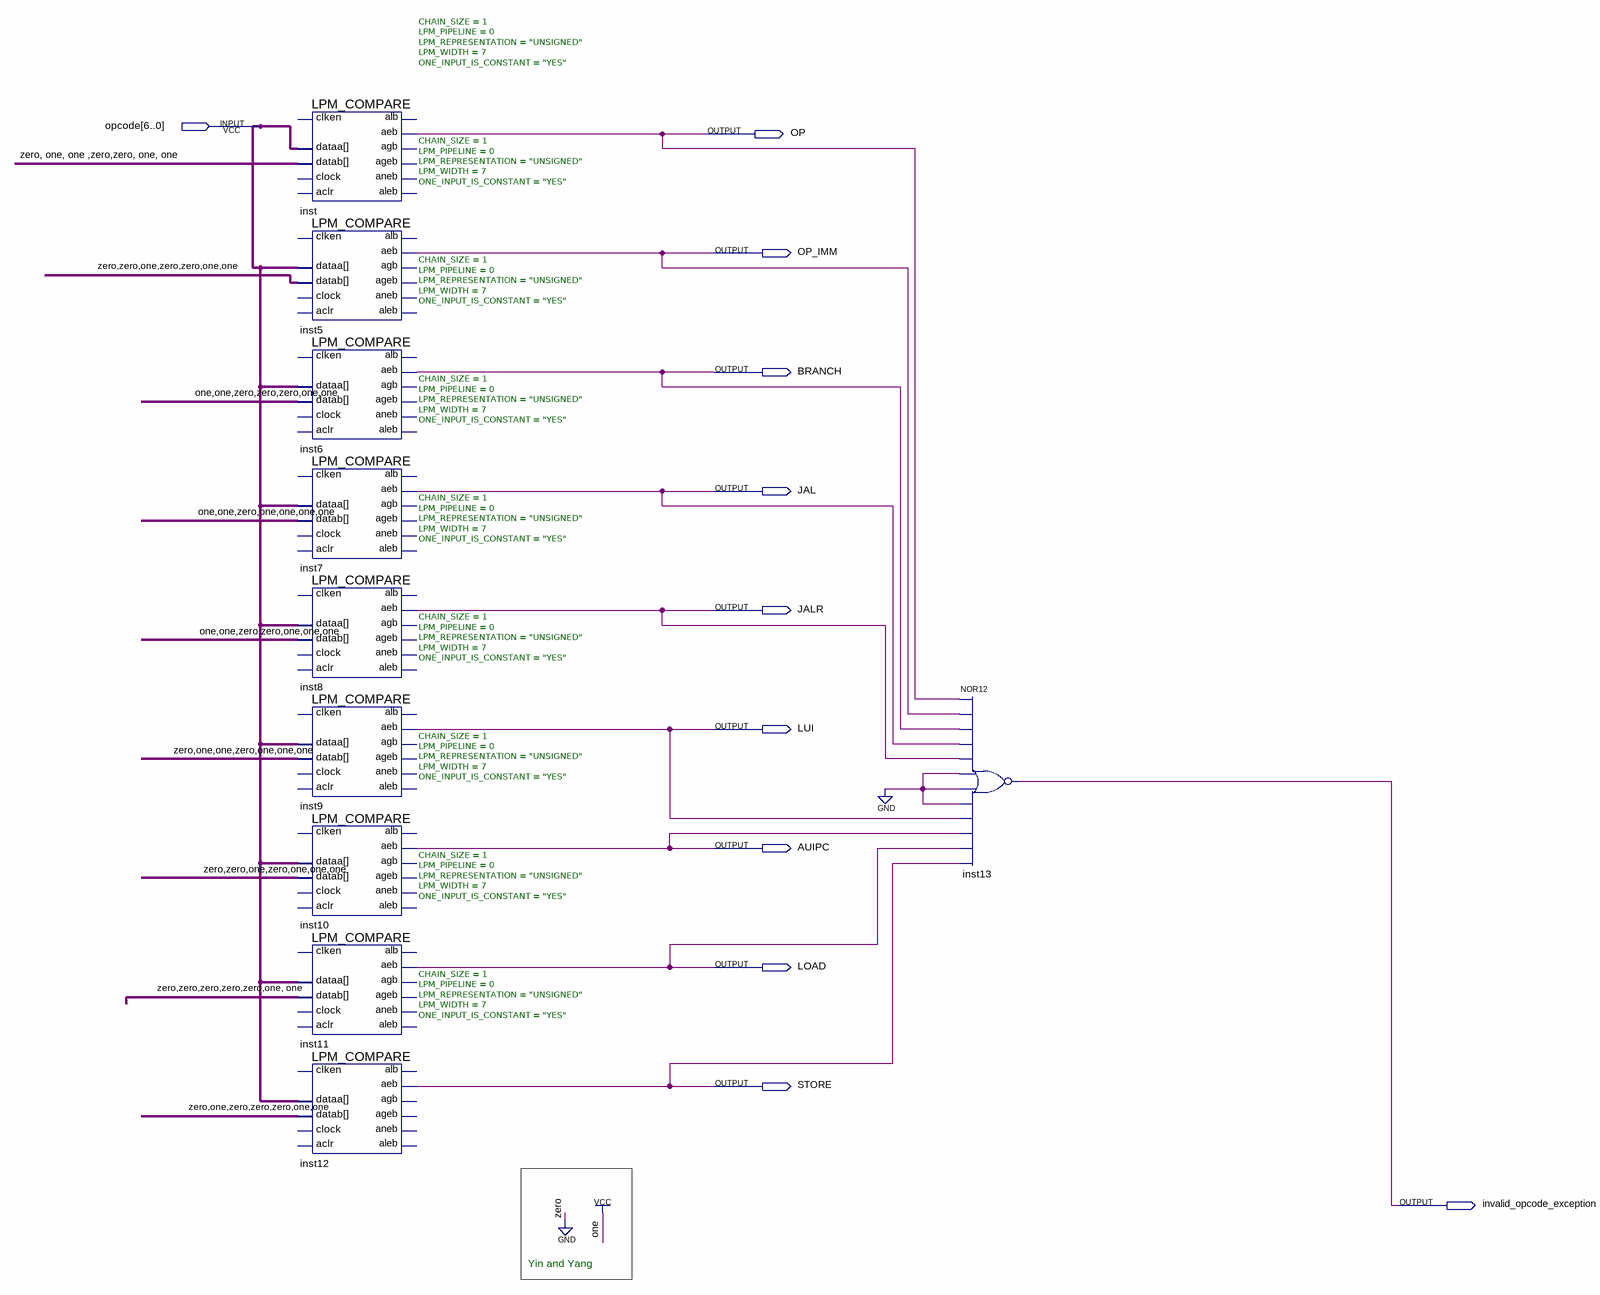
[diagram p0: schematic sheet]
// Quartus schematic OpcodeDecoder.bdf as structural Verilog: 10 symbols, 11 pins
module OpcodeDecoder (
  input  [6:0] opcode,
  output OP,
  output OP_IMM,
  output BRANCH,
  output JAL,
  output JALR,
  output LUI,
  output AUIPC,
  output LOAD,
  output STORE,
  output invalid_opcode_exception
);

  LPM_COMPARE #(.CHAIN_SIZE(1), .LPM_PIPELINE(0), .LPM_REPRESENTATION("UNSIGNED"), .LPM_WIDTH(7), .ONE_INPUT_IS_CONSTANT("YES")) inst (
    .dataa(opcode), .datab(7'b0110011), .aeb(OP));  // open: clock, aclr, clken, aleb, agb, aneb, ageb, alb
  LPM_COMPARE #(.CHAIN_SIZE(1), .LPM_PIPELINE(0), .LPM_REPRESENTATION("UNSIGNED"), .LPM_WIDTH(7), .ONE_INPUT_IS_CONSTANT("YES")) inst5 (
    .dataa(opcode), .datab(7'b0010011), .aeb(OP_IMM));  // open: clock, aclr, clken, aleb, agb, aneb, ageb, alb
  LPM_COMPARE #(.CHAIN_SIZE(1), .LPM_PIPELINE(0), .LPM_REPRESENTATION("UNSIGNED"), .LPM_WIDTH(7), .ONE_INPUT_IS_CONSTANT("YES")) inst6 (
    .dataa(opcode), .datab(7'b1100011), .aeb(BRANCH));  // open: clock, aclr, clken, aleb, agb, aneb, ageb, alb
  LPM_COMPARE #(.CHAIN_SIZE(1), .LPM_PIPELINE(0), .LPM_REPRESENTATION("UNSIGNED"), .LPM_WIDTH(7), .ONE_INPUT_IS_CONSTANT("YES")) inst7 (
    .dataa(opcode), .datab(7'b1101111), .aeb(JAL));  // open: clock, aclr, clken, aleb, agb, aneb, ageb, alb
  LPM_COMPARE #(.CHAIN_SIZE(1), .LPM_PIPELINE(0), .LPM_REPRESENTATION("UNSIGNED"), .LPM_WIDTH(7), .ONE_INPUT_IS_CONSTANT("YES")) inst8 (
    .dataa(opcode), .datab(7'b1100111), .aeb(JALR));  // open: clock, aclr, clken, aleb, agb, aneb, ageb, alb
  LPM_COMPARE #(.CHAIN_SIZE(1), .LPM_PIPELINE(0), .LPM_REPRESENTATION("UNSIGNED"), .LPM_WIDTH(7), .ONE_INPUT_IS_CONSTANT("YES")) inst9 (
    .dataa(opcode), .datab(7'b0110111), .aeb(LUI));  // open: clock, aclr, clken, aleb, agb, aneb, ageb, alb
  LPM_COMPARE #(.CHAIN_SIZE(1), .LPM_PIPELINE(0), .LPM_REPRESENTATION("UNSIGNED"), .LPM_WIDTH(7), .ONE_INPUT_IS_CONSTANT("YES")) inst10 (
    .dataa(opcode), .datab(7'b0010111), .aeb(AUIPC));  // open: clock, aclr, clken, aleb, agb, aneb, ageb, alb
  LPM_COMPARE #(.CHAIN_SIZE(1), .LPM_PIPELINE(0), .LPM_REPRESENTATION("UNSIGNED"), .LPM_WIDTH(7), .ONE_INPUT_IS_CONSTANT("YES")) inst11 (
    .dataa(opcode), .datab(7'b0000011), .aeb(LOAD));  // open: clock, aclr, clken, aleb, agb, aneb, ageb, alb
  LPM_COMPARE #(.CHAIN_SIZE(1), .LPM_PIPELINE(0), .LPM_REPRESENTATION("UNSIGNED"), .LPM_WIDTH(7), .ONE_INPUT_IS_CONSTANT("YES")) inst12 (
    .dataa(opcode), .datab(7'b0100011), .aeb(STORE));  // open: clock, aclr, clken, aleb, agb, aneb, ageb, alb
  nor inst13 (invalid_opcode_exception, OP, OP_IMM, BRANCH, JAL, JALR, 1'b0, 1'b0, 1'b0, LUI, AUIPC, LOAD, STORE);

  // Notes on the sheet:
  //   Yin and Yang
endmodule
